# Altium schematic sheet SH1 - POWER.SchDoc: Power
size B; CheckedBy: Lance Bantoto; Engineer: Cindy Li; Organization: UW Robotics; Address1: 200 University Avenue; Address2: Waterloo; Address3: Ontario; Address4: Canada N2L 3G6; DocumentNumber: 1; Revision: 2; SheetNumber: 1; SheetTotal: 10
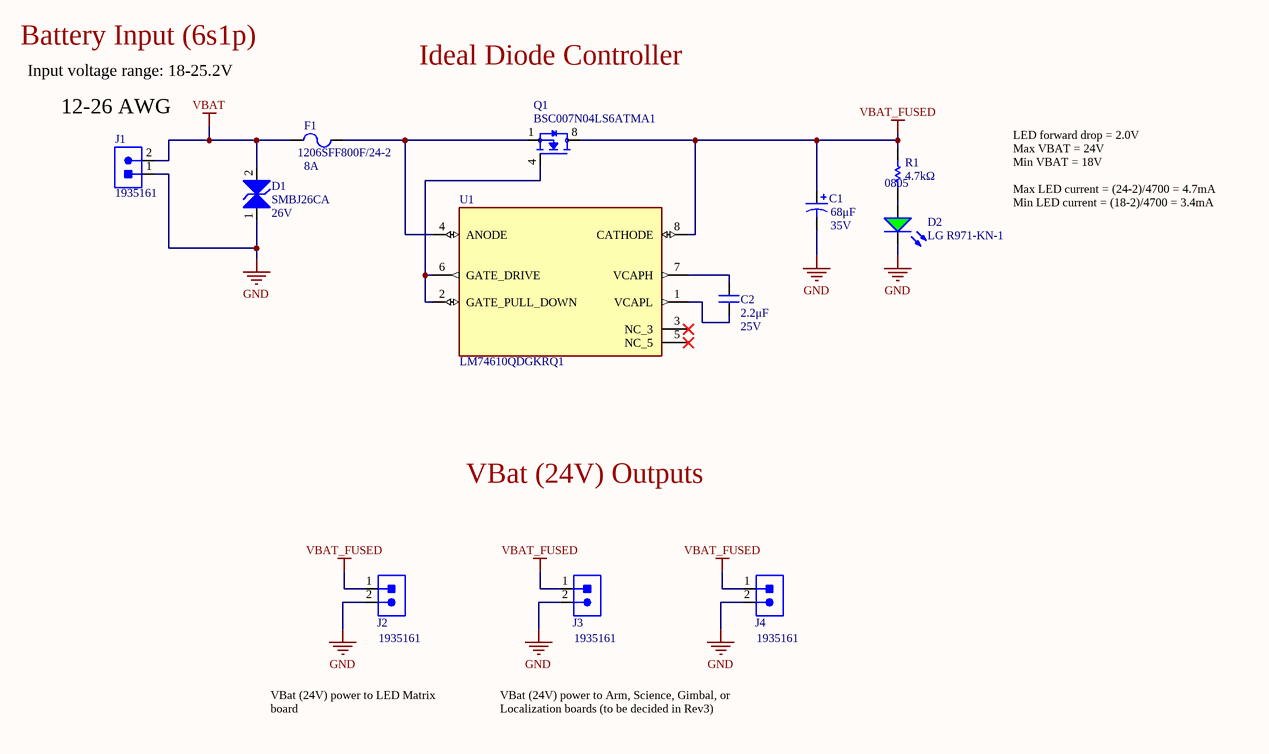
[diagram p0: SH1 - POWER.SchDoc]

## Parts
C1  value 68μF  Voltage Rating: 35V  [RADIAL_NICHION_1V]  (hidden comment: CAP_68uF_35V_ALUM)
C2  value 2.2μF  Voltage Rating: 25V  [CAP2012]  (hidden comment: CAP_2.2uF_25V_0805)
D1  Manufacturer Part Number 1: SMBJ26CA  Reverse Standoff Voltage: 26V  [TVS_DIODE_BIDIRECTIONAL]  (hidden comment: TVS_DIODE_BIDIR_26V)
D2  Manufacturer Part Number 1: LG R971-KN-1  [LED_0805_GREEN]  (hidden comment: DIO_LED_G)
F1  Manufacturer Part Number 1: 1206SFF800F/24-2  Current Rating: 8A  [FUSE_1206]  (hidden comment: FUSE_8A_1206)
J1  CON_2M_TERM  [1935161]  (value not drawn)
J2  CON_2M_TERM  [1935161]  (value not drawn)
J3  CON_2M_TERM  [1935161]  (value not drawn)
J4  CON_2M_TERM  [1935161]  (value not drawn)
Q1  Manufacturer Part Number 1: BSC007N04LS6ATMA1  [TRANS_BSC007N04LS6ATMA1]  (hidden comment: NMOS_40V_100A)
R1  value 4.7kΩ  Package/Footprint: 0805  [RESC0805]  (hidden comment: RES_4.7kΩ_0805_5%)
U1  LM74610QDGKRQ1  [SOP65P490X110-8N]

## Nets
GND: C1.2 D1.1 D2.2(K) J1.1 J2.2 J3.2 J4.2
VBAT: D1.2 F1.1 J1.2
VBAT_FUSED: C1.1 J2.1 J3.1 J4.1 Q1.8(D) R1.2 U1.8(CATHODE)
NetC2_1: C2.1 U1.1(VCAPL)
NetC2_2: C2.2 U1.7(VCAPH)
NetD2_1: D2.1(A) R1.1
NetF1_2: F1.2 Q1.1(S) U1.4(ANODE)
NetQ1_4: Q1.4(G) U1.2(GATE_PULL_DOWN) U1.6(GATE_DRIVE)

Not connected (* = marked no-connect by the designer): U1 3(NC_3)* 5(NC_5)*

## Notes on the sheet
- Battery Input (6s1p)
- Input voltage range: 18-25.2V
- Ideal Diode Controller
- (near J1) 12-26 AWG
- LED forward drop = 2.0V
  Max VBAT = 24V
  Min VBAT = 18V
  Max LED current = (24-2)/4700 = 4.7mA
  Min LED current = (18-2)/4700 = 3.4mA
- VBat (24V) Outputs
- VBat (24V) power to LED Matrix board
- VBat (24V) power to Arm, Science, Gimbal, or Localization boards (to be decided in Rev3)
- Title:
- Project:
- Date:
- Rev:
- Reviewer:
- Engineer:
- Sheet:
- of

## Library data of the parts
C1 = CAP_68uF_35V_ALUM: CAP ALUM 68UF 20% 35V SMD; Manufacturer 1: Nichicon; Manufacturer Part Number 1: UUD1V680MCL1GS; ESR (Equivalent Series Resistance): 340mR; Polarity: Polar; Voltage Rating (DC): 50V; Supplier 1: Digi-Key; Min Operating Temperature: -55°C; Max Operating Temperature: 105°C; Tolerance: 20%; Diameter: 6.3mm; Height - Seated (Max): 7.7mm; Supplier Part Number 1: 493-2289-1-ND; Mounting Type: SMD; Package/Footprint: SMD
C2 = CAP_2.2uF_25V_0805: CAP CER 2.2UF 25V X7R 0805; Manufacturer 1: Samsung Electro-Mechanics; Manufacturer Part Number 1: CL21B225KAFNNWE; Package/Footprint: 0805; Supplier 1: Digi-Key; Supplier Part Number 1: 1276-2955-1-ND; LCSC Part #: C49217; Mounting Type: SMD
D1 = TVS_DIODE_BIDIR_26V: TVS DIODE 26V 42.1V DO214AA; Manufacturer 1: Littelfuse; Min Breakdown Voltage: 28.9V; Direction: Bidirectional; Package/Footprint: SMB; Supplier 1: Digi-Key; Clamping Voltage: 42.1V; Supplier Part Number 1: SMBJ26CALFCT-ND; LCSC Part #: C8835; Mounting Type: SMD
D2 = DIO_LED_G: LED GREEN DIFFUSED 0805 SMD; Manufacturer 1: OSRAM; Forward Voltage Drop: 2.2V; Package/Footprint: 0805; Supplier Part Number 1: 475-1410-1-ND; Supplier 1: Digi-Key; Mounting Type: SMD
F1 = FUSE_8A_1206: FUSE SMD 8A 24V; Manufacturer 1: Littelfuse; Package/Footprint: 1206; Supplier 1: Digi-Key; Supplier Part Number 1: 1206SFF800F/24-2CT-ND; LCSC Part #: C311032; Mounting Type: SMD
J1 = CON_2M_TERM: TERM BLK 2POS SIDE ENTRY 5MM; Manufacturer 1: Phoenix Contact; Voltage: 300V; Current: 18A; Max Current Rating: 16A; Package/Footprint: SMD; Supplier 1: Digi-Key; Manufacturer Part Number 1: 1935161; Supplier Part Number 1: 277-1667-ND; Mounting Type: TH
J2-J4 = CON_2M_TERM: TERM BLK 2POS SIDE ENTRY 5MM; Manufacturer 1: Phoenix Contact; Max Current Rating: 16A; Current: 18A; Voltage: 300V; Package/Footprint: SMD; Supplier 1: Digi-Key; Supplier Part Number 1: 277-1667-ND; Manufacturer Part Number 1: 1935161; Mounting Type: TH
Q1 = NMOS_40V_100A: N-Channel 40V 100A 188W Surface Mount PG-TDSON-8-6; Manufacturer 1: Infineon Technologies; Drive Voltage (Max Rds On, Min Rds On): 4.5V, 10V; Rds On (Max) @ Id, Vgs: 0.7mOhm @ 50A, 10V; Vgs (Max): ±20V; Package/Footprint: 8-PowerTDFN; Supplier 1: Digi-Key; Supplier Part Number 1: BSC007N04LS6ATMA1CT-ND; Continuous Drain Current (Id) @ 25°C: 100A; Power Dissipation: 188W; FET Type: N-Channel; Operating Temperature: -55°C ~ 175°C (TJ); Mounting Type: SMD; Drain to Source Voltage (Vdss): 40V; Parameter 1: *
R1 = RES_4.7kΩ_0805_5%: RES 4.7K OHM 5% 1/8W 0805; Manufacturer 1: Yageo; Manufacturer Part Number 1: RC0805JR-074K7L; Supplier 1: Digi-Key; Supplier Part Number 1: 311-4.7KARCT-ND; LCSC Part #: C17673; Mounting Type: SMD
U1 = LM74610QDGKRQ1: IC SMART DIODE CTLR 8VSSOP; Manufacturer 1: Texas Instruments; Supply Voltage (Max): 42V; Package/Footprint: 8-TSSOP; Supplier 1: Digi-Key; Supplier Part Number 1: 296-43067-1-ND; Manufacturer Part Number 1: LM74610QDGKRQ1; LCSC Part #: C202259; Mounting Type: SMD